# Altium project wol pcb.PrjPcb
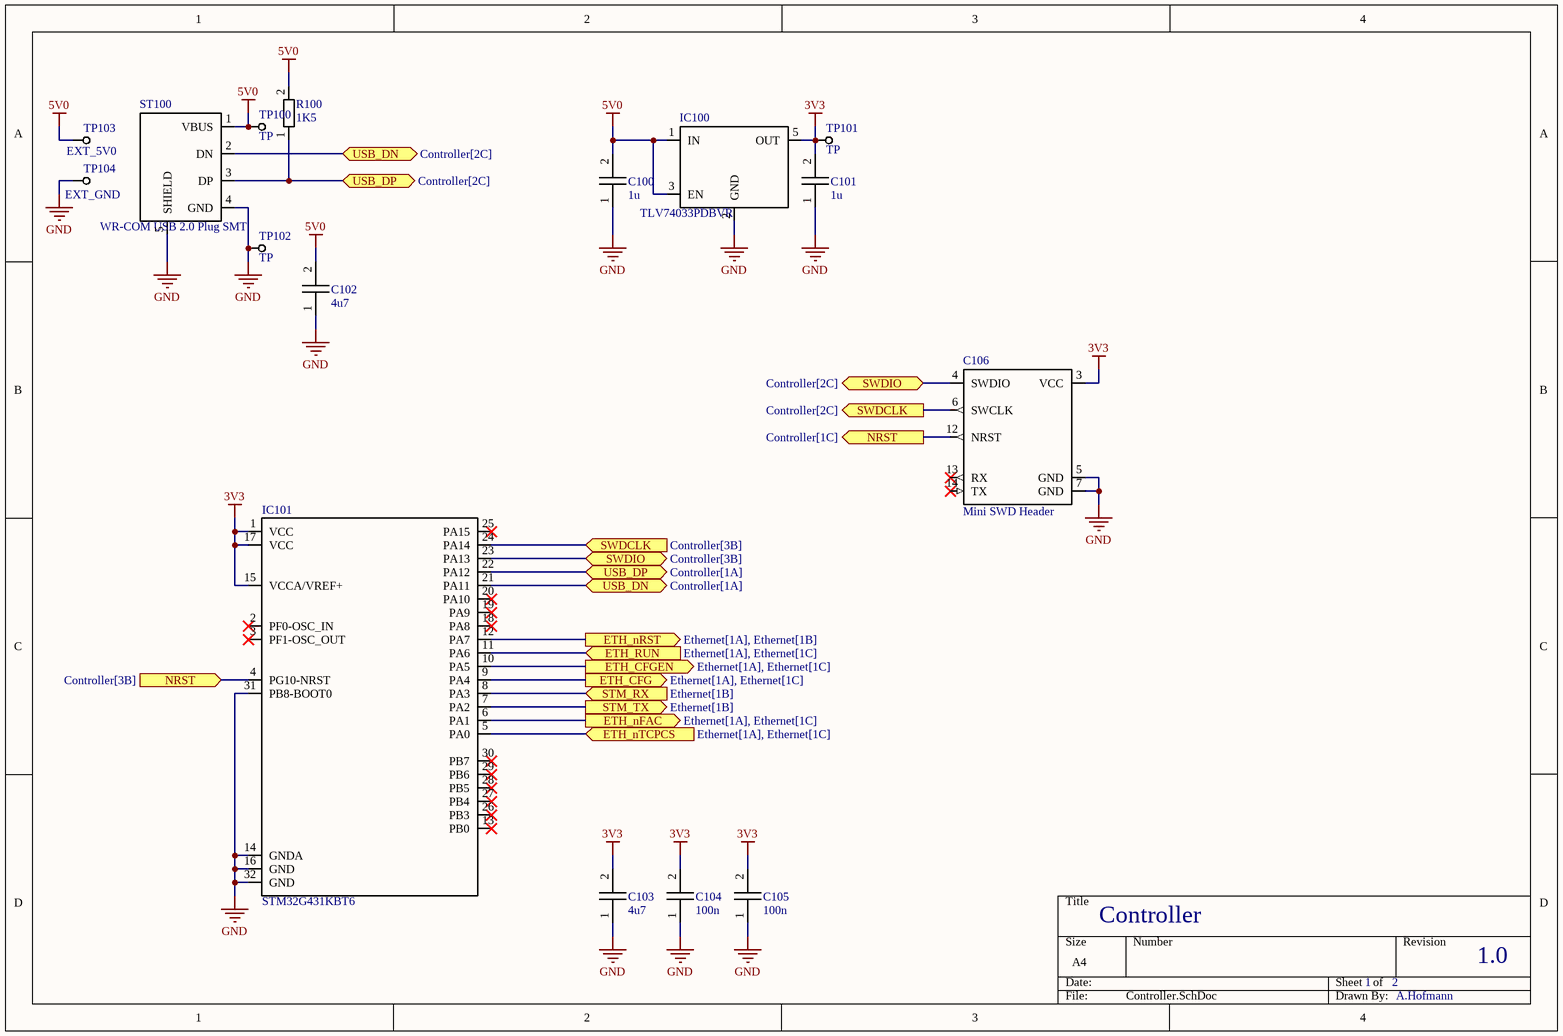
[diagram p0: Controller.SchDoc]
2 sheets, 33 parts. Net scope: flat (ports and power ports of the same name join across sheets).
Board file: wol_pcb.PcbDoc
Sheets:
  Controller.SchDoc
  Ethernet.SchDoc

## Sheet Controller.SchDoc: Wake on LAN Hardware Design
size A4; Author: Severin Sprenger; DrawnBy: Severin Sprenger; DocumentNumber: 18032023; Revision: 1; SheetNumber: 1; SheetTotal: 2

### Parts
C100  1u  [C_0402]
C101  1u  [C_0402]
C102  4u7  [C_0603]
C103  4u7  [C_0603]
C104  100n  [C_0402]
C105  100n  [C_0402]
C106  Mini SWD Header  [Mini SWD Header]
IC100  TLV74033PDBVR  [SOT-23]
IC101  STM32G431KBT6  [LQFP32]
R100  1K5  [R_0402]
ST100  WR-COM USB 2.0 Plug SMT  [629004113921]
TP100  TP  [STP_0.5mm]
TP101  TP  [STP_0.5mm]
TP102  TP  [STP_0.5mm]
TP103  EXT_5V0  [TTP_1mm]
TP104  EXT_GND  [TTP_1mm]

### Ports
ETH_CFG (out, see Ethernet[1A], Ethernet[1C]), ETH_CFGEN (out, see Ethernet[1A], Ethernet[1C]), ETH_nFAC (out, see Ethernet[1A], Ethernet[1C]), ETH_nRST (out, see Ethernet[1A], Ethernet[1B]), ETH_nTCPCS (in, see Ethernet[1A], Ethernet[1C]), ETH_RUN (in, see Ethernet[1A], Ethernet[1C]), NRST (in, see Controller[3B]), NRST (out, see Controller[1C]), STM_RX (in, see Ethernet[1B]), STM_TX (out, see Ethernet[1B]), SWDCLK (in, see Controller[3B]), SWDCLK (out, see Controller[2C]), SWDIO (bidir, see Controller[2C]), SWDIO (bidir, see Controller[3B]), USB_DN (bidir, see Controller[1A]), USB_DN (bidir, see Controller[2C]), USB_DP (bidir, see Controller[1A]), USB_DP (bidir, see Controller[2C])

### Nets
3V3: C101.2 C103.2 C104.2 C105.2 C106.3(VCC) IC100.5(OUT) IC101.1(VCC) IC101.15(VCCA/VREF+) IC101.17(VCC) TP101.1
5V0: C100.2 C102.2 IC100.1(IN) IC100.3(EN) R100.2 ST100.1(VBUS) TP100.1 TP103.1
GND: C100.1 C101.1 C102.1 C103.1 C104.1 C105.1 C106.5(GND) C106.7(GND) IC100.2(GND) IC101.14(GNDA) IC101.16(GND) IC101.31(PB8-BOOT0) IC101.32(GND) ST100.4(GND) ST100.5(SHIELD) TP102.1 TP104.1
ETH_CFG: IC101.9(PA4) ; port ETH_CFG
ETH_CFGEN: IC101.10(PA5) ; port ETH_CFGEN
ETH_nFAC: IC101.6(PA1) ; port ETH_nFAC
ETH_nRST: IC101.12(PA7) ; port ETH_nRST
ETH_nTCPCS: IC101.5(PA0) ; port ETH_nTCPCS
ETH_RUN: IC101.11(PA6) ; port ETH_RUN
NRST: C106.12(NRST) IC101.4(PG10-NRST) ; port NRST
STM_RX: IC101.8(PA3) ; port STM_RX
STM_TX: IC101.7(PA2) ; port STM_TX
SWDCLK: C106.6(SWCLK) IC101.24(PA14) ; port SWDCLK
SWDIO: C106.4(SWDIO) IC101.23(PA13) ; port SWDIO
USB_DN: IC101.21(PA11) ST100.2(DN) ; port USB_DN
USB_DP: IC101.22(PA12) R100.1 ST100.3(DP) ; port USB_DP

Not connected (* = marked no-connect by the designer): C106 13(RX)* 14(TX)*; IC101 2(PF0-OSC_IN)* 3(PF1-OSC_OUT)* 13(PB0)* 18(PA8)* 19(PA9)* 20(PA10)* 25(PA15)* 26(PB3)* 27(PB4)* 28(PB5)* 29(PB6)* 30(PB7)*

### Notes on the sheet
- Controller
- 1
- 2
- 1.0
- A.Hofmann

### Library data of the parts
C100-C105 = CeCa
C106 = Mini SWD Header: Manufacturer Nr.: 3220-14-0300-00
IC100 = TLV74033PDBVR: Linear Voltage Regulator IC Positive Fixed 1 Output 300mA SOT-23-5; ComponentLink1Description: New link; ComponentLink1URL: https://www.ti.com/lit/ds/symlink/tlv740p.pdf?ts=1680939934820
IC101 = STM32G431KBT6: ARM Microcontrollers - MCU Mainstream Arm Cortex-M4 MCU 170 MHz 128 Kbytes of Flash Math Accel, Medium Anal; ComponentLink1Description: Datasheet; ComponentLink1URL: https://www.st.com/resource/en/datasheet/stm32g431kb.pdf
R100 = Res
ST100 = WR-COM USB 2.0 Plug SMT: CONN PLUG USB2.0 TYPEA 4P SMD RA; ComponentLink1Description: New link; ComponentLink1URL: https://www.we-online.com/components/products/datasheet/629004113921.pdf
TP103 TP104 = TP

## Sheet Ethernet.SchDoc
size A4; SheetNumber: 2; SheetTotal: 2
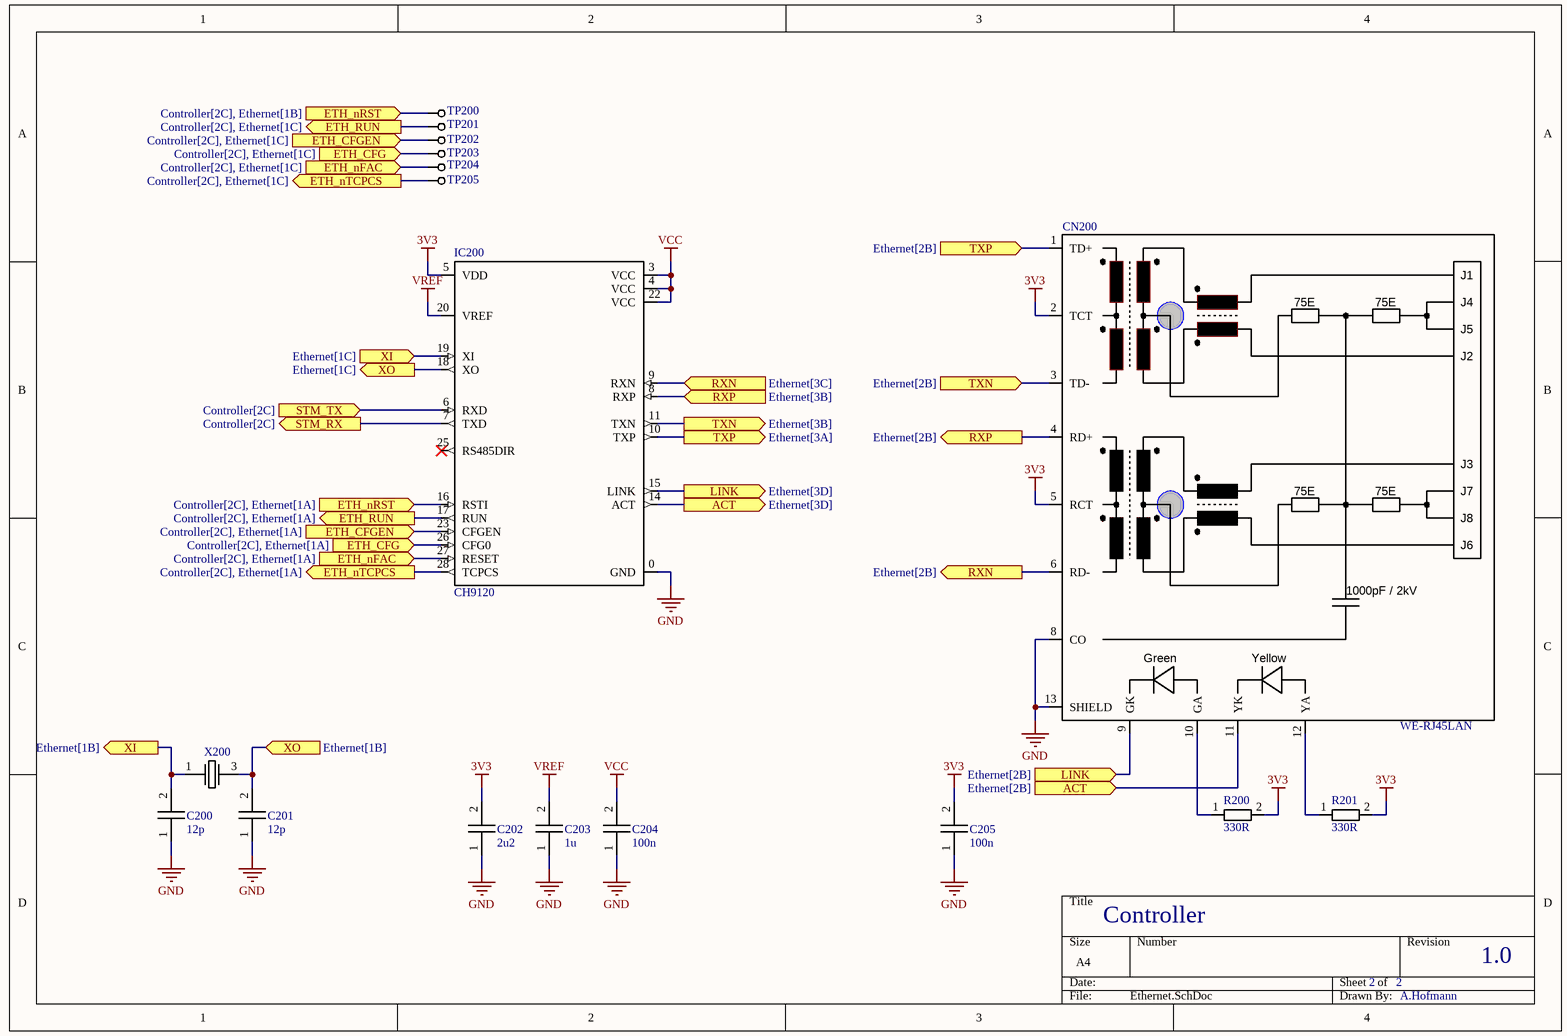
[diagram p1: Ethernet.SchDoc]

### Parts
C200  12p  [C_0402]
C201  12p  [C_0402]
C202  2u2  [C_0603]
C203  1u  [C_0603]
C204  100n  [C_0402]
C205  100n  [C_0402]
CN200  WE-RJ45LAN  [7499010121A]
IC200  CH9120  [QFN28]
R200  330R  [R_0402]
R201  330R  [R_0402]
TP200  TP  [STP_0.5mm]  (value not drawn)
TP201  TP  [STP_0.5mm]  (value not drawn)
TP202  TP  [STP_0.5mm]  (value not drawn)
TP203  TP  [STP_0.5mm]  (value not drawn)
TP204  TP  [STP_0.5mm]  (value not drawn)
TP205  TP  [STP_0.5mm]  (value not drawn)
X200  XRCGB32M000F0L00R0  [HCR2016]  (value not drawn)

### Ports
ACT (in, see Ethernet[2B]), ACT (out, see Ethernet[3D]), ETH_CFG (in, see Controller[2C], Ethernet[1A]), ETH_CFG (in, see Controller[2C], Ethernet[1C]), ETH_CFGEN (in, see Controller[2C], Ethernet[1A]), ETH_CFGEN (in, see Controller[2C], Ethernet[1C]), ETH_nFAC (in, see Controller[2C], Ethernet[1A]), ETH_nFAC (in, see Controller[2C], Ethernet[1C]), ETH_nRST (in, see Controller[2C], Ethernet[1A]), ETH_nRST (in, see Controller[2C], Ethernet[1B]), ETH_nTCPCS (out, see Controller[2C], Ethernet[1A]), ETH_nTCPCS (out, see Controller[2C], Ethernet[1C]), ETH_RUN (out, see Controller[2C], Ethernet[1A]), ETH_RUN (out, see Controller[2C], Ethernet[1C]), LINK (in, see Ethernet[2B]), LINK (out, see Ethernet[3D]), RXN (in, see Ethernet[3C]), RXN (out, see Ethernet[2B]), RXP (in, see Ethernet[3B]), RXP (out, see Ethernet[2B]), STM_RX (out, see Controller[2C]), STM_TX (in, see Controller[2C]), TXN (in, see Ethernet[2B]), TXN (out, see Ethernet[3B]), TXP (in, see Ethernet[2B]), TXP (out, see Ethernet[3A]), XI (in, see Ethernet[1C]), XI (out, see Ethernet[1B]), XO (in, see Ethernet[1B]), XO (out, see Ethernet[1C])

### Nets
3V3: C202.2 C205.2 CN200.2(TCT) CN200.5(RCT) IC200.5(VDD) R200.2 R201.2
GND: C200.1 C201.1 C202.1 C203.1 C204.1 C205.1 CN200.8(CO) CN200.13(SHIELD) IC200.0(GND)
VCC: C204.2 IC200.3(VCC) IC200.4(VCC) IC200.22(VCC)
VREF: C203.2 IC200.20(VREF)
ACT: CN200.11(YK) IC200.14(ACT) ; port ACT
ETH_CFG: IC200.26(CFG0) TP203.1 ; port ETH_CFG
ETH_CFGEN: IC200.23(CFGEN) TP202.1 ; port ETH_CFGEN
ETH_nFAC: IC200.27(RESET) TP204.1 ; port ETH_nFAC
ETH_nRST: IC200.16(RSTI) TP200.1 ; port ETH_nRST
ETH_nTCPCS: IC200.28(TCPCS) TP205.1 ; port ETH_nTCPCS
ETH_RUN: IC200.17(RUN) TP201.1 ; port ETH_RUN
LINK: CN200.9(GK) IC200.15(LINK) ; port LINK
RXN: CN200.6(RD-) IC200.9(RXN) ; port RXN
RXP: CN200.4(RD+) IC200.8(RXP) ; port RXP
STM_RX: IC200.7(TXD) ; port STM_RX
STM_TX: IC200.6(RXD) ; port STM_TX
TXN: CN200.3(TD-) IC200.11(TXN) ; port TXN
TXP: CN200.1(TD+) IC200.10(TXP) ; port TXP
XI: C200.2 IC200.19(XI) X200.1 ; port XI
XO: C201.2 IC200.18(XO) X200.3 ; port XO
NetCN200_10: CN200.10(GA) R200.1
NetCN200_12: CN200.12(YA) R201.1

Not connected (* = marked no-connect by the designer): IC200 25(RS485DIR)*

### Notes on the sheet
- Controller
- 2
- 1.0
- A.Hofmann
- (in symbol WE-RJ45LAN) J1; 75E; J4; J5; J2; J3; J7; J8; J6; 1000pF / 2kV; Green; Yellow

### Library data of the parts
C200-C205 = CeCa
CN200 = WE-RJ45LAN: Modulare Steckverbinder / Ethernet-Steckverbinder WE-RJ45 Intgtd XFMR 1x1 THT Tab Up; ComponentLink1Description: Datasheet; ComponentLink1URL: https://www.we-online.com/components/products/datasheet/7499010121A.pdf
IC200 = CH9120: Network and UART Transparent Transmission Chip; ComponentLink1Description: Datasheet; ComponentLink1URL: http://www.wch-ic.com/downloads/file/317.html?time=2022-08-22%2013:41:33&code=5fVJkrWqOqsN9oFySIYUkoTgQwx098RKZyXylZKH
R200 R201 = Res
X200 = XRCGB32M000F0L00R0: ComponentLink1Description: New link; ComponentLink1URL: https://www.murata.com/products/productdata/8801079099422/SPEC-XRCGB32M000F0L00R0.pdf?1541043011000

## Nets that join several sheets
3V3: Controller (10 pins), Ethernet (7 pins)
GND: Controller (17 pins), Ethernet (9 pins)
ETH_CFG: Controller (IC101.9), Ethernet (IC200.26 TP203.1)
ETH_CFGEN: Controller (IC101.10), Ethernet (IC200.23 TP202.1)
ETH_nFAC: Controller (IC101.6), Ethernet (IC200.27 TP204.1)
ETH_nRST: Controller (IC101.12), Ethernet (IC200.16 TP200.1)
ETH_nTCPCS: Controller (IC101.5), Ethernet (IC200.28 TP205.1)
ETH_RUN: Controller (IC101.11), Ethernet (IC200.17 TP201.1)
STM_RX: Controller (IC101.8), Ethernet (IC200.7)
STM_TX: Controller (IC101.7), Ethernet (IC200.6)